# EAGLE design PCB-REMCON (EAGLE 6.4)
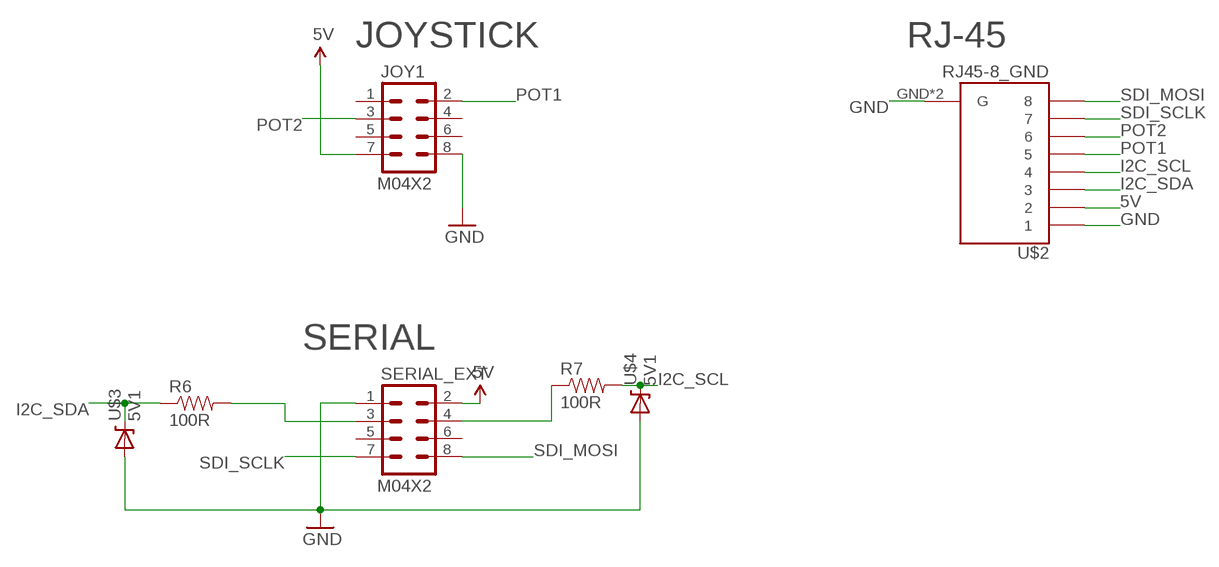
[diagram p0: schematic, sheet 1]

## Parts
JOY1  M04X2  [2X4]
R6  100R  RESISTOR0603-RES  [0603-RES]
R7  100R  RESISTOR0603-RES  [0603-RES]
SERIAL_EXT  M04X2  [2X4]
U$2  RJ45-8_GND  [RJ45-8_GND]
U$3  5V1  DIODE-ZENERPTH  [DIODE-ZENER]
U$4  5V1  DIODE-ZENERPTH  [DIODE-ZENER]

## Nets
5V [Power]: JOY1.7 SERIAL_EXT.2 U$2.2
GND [Power]: JOY1.8 SERIAL_EXT.1 U$2.1 U$2.GND1(G) U$2.GND(G) U$3.P$2(A) U$4.P$2(A)
I2C_SCL: R7.2 U$2.4 U$4.P$1(C)
I2C_SDA: R6.1 U$2.3 U$3.P$1(C)
N$1: R6.2 SERIAL_EXT.3
N$14: R7.1 SERIAL_EXT.4
POT1: JOY1.2 U$2.5
POT2: JOY1.3 U$2.6
SDI_MOSI: SERIAL_EXT.8 U$2.8
SDI_SCLK: SERIAL_EXT.7 U$2.7
Unconnected: JOY1.1 JOY1.4 JOY1.5 JOY1.6 SERIAL_EXT.5 SERIAL_EXT.6

## Notes on the sheet
- JOYSTICK | RJ-45
- SERIAL

## Library data of the parts
JOY1 SERIAL_EXT = SparkFun:M04X2
R6 R7 = SparkFun:RESISTOR: Resistor Basic schematic elements and footprints for 0603, 1206, and PTH resistors.
U$2 = SKAARHOJ:RJ45-8_GND
U$3 U$4 = SparkFun:DIODE-ZENER: Zener Diode Production Part - 8199 3.4V Zener Voltage

## Net classes
0 default: width 0.203 mm, drill 0.406 mm, clearance 0.203 mm
1 Power: width 0.406 mm, drill 0.61 mm, clearance 0.203 mm

## Board
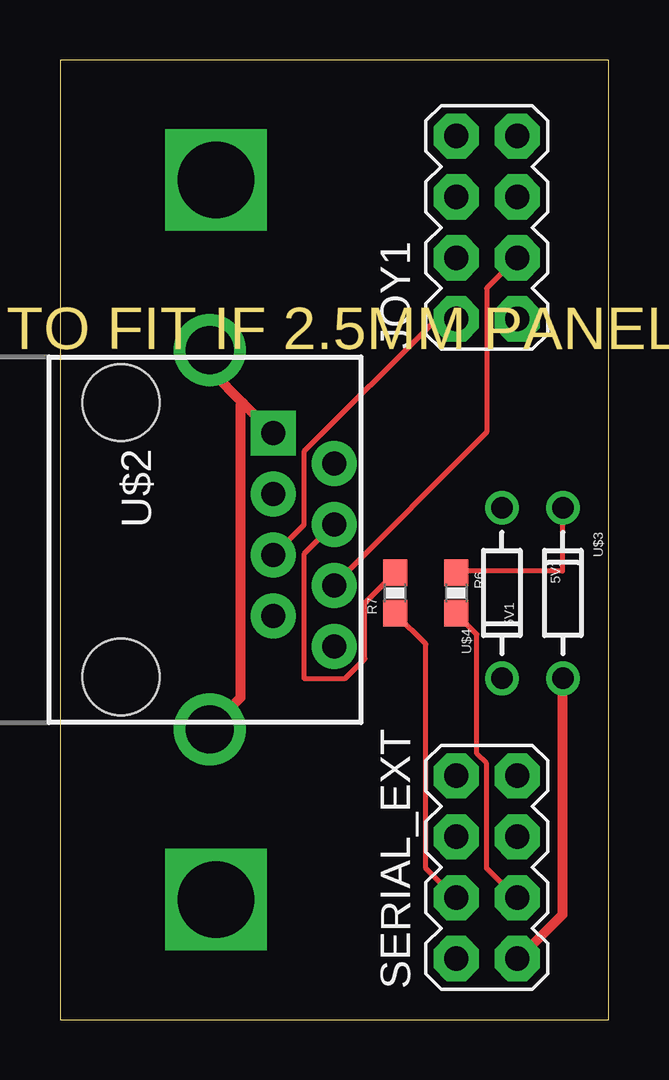
[diagram p1: board, top side]
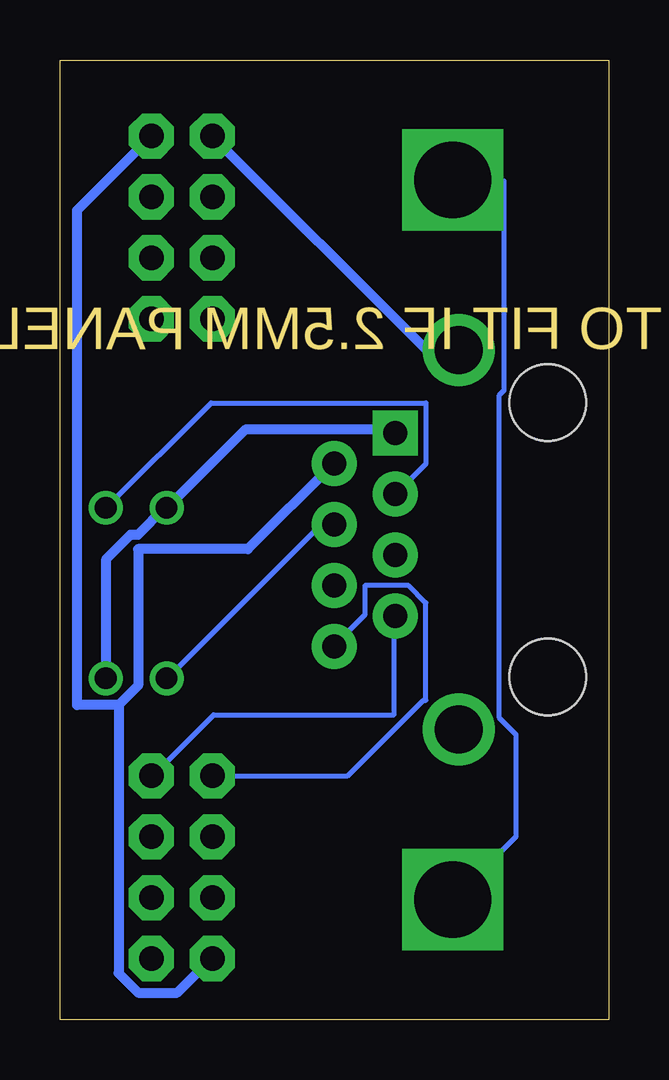
[diagram p2: board, bottom side, seen from below]

Size 22.86 x 40 mm. Coordinates in mm from the lower left corner, seen from the top.
Outline: 0,0 22.86,0 22.86,40 0,40 0,0
Copper layers (1*16): Top 0.035mm / dielectric 1.5mm / Bottom 0.035mm
Design rules "Fusion_eagle_rule_v1.1": minimum track width 6mil, minimum drill 12mil, track to track 6mil, track to pad 6mil, pad to pad 6mil, via to via 6mil, smd to smd 0mil, copper to edge 10mil, drill to drill 10mil, minimum pad ring 10mil, minimum via ring 6mil, stop-mask expansion 2mil, vias tented up to drill 100mil, thermal gap 10mil
tRestrict: area 0,0 to 10.2,10.2; area 0,30.5 to 10.2,40.6

### Footprints (pad centres in the part's own frame; a part is rotated, then mirrored left to right if it is on the bottom)
2X4 = drill 1.016 pad 1.88 octagon: 1 -3.81,-1.27; 2 -3.81,1.27; 3 -1.27,-1.27; 4 -1.27,1.27; 5 1.27,-1.27; 6 1.27,1.27; 7 3.81,-1.27; 8 3.81,1.27
0603-RES = smd 1.1 x 1: 1 -0.85,0; 2 0.85,0
RJ45-8_GND = drill 1 pad 1.88 square: 1 -4.445,6.35 | drill 1 pad 1.88: 2 -3.175,8.89; 3 -1.905,6.35; 4 -0.635,8.89; 5 0.635,6.35; 6 1.905,8.89; 7 3.175,6.35; 8 4.445,8.89 | drill 2: GND -7.9,3.7; GND1 7.9,3.7 | hole 3.2: -5.715,0; 5.715,0
DIODE-ZENER = drill 0.9: P$1 -3.556,0; P$2 3.556,0

### Placement (x,y rotation side)
JOY1  17.78,33.02 90 top
R6  16.51,17.78 270 top
R7  13.97,17.78 90 top
SERIAL_EXT  17.78,6.35 90 top
U$2  2.54,20 270 top
U$3  20.95,17.78 270 top
U$4  18.41,17.78 90 top

### Tracks (layer width: path | path; a pad name or v marks a point on that pad's centre or on a via)
5V
  Bottom 0.406: 20.42,13.11 20.42,1.93 19.61,1.12 17.98,1.12 16.56,2.54 SERIAL_EXT.2 | 20.42,13.11 19.61,13.92 19.61,19.61 15.04,19.61 11.48,23.16 U$2.2 | JOY1.7 22.15,33.73 22.15,13.11 20.42,13.11
GND
  Top 0.406: SERIAL_EXT.1 19.1,2.54 20.93,4.37 20.93,14.22 U$3.P$2 | 7.62,25.7 6.3,27.03 6.3,27.84 U$2.GND | 7.62,25.7 8.84,24.49 U$2.1 | U$2.GND1 6.3,12.19 7.52,13.41 7.52,25.6 7.62,25.7
  Bottom 0.406: U$3.P$2 20.93,14.22 20.93,19.2 19.91,20.22 19.61,20.22 18.49,21.34 U$4.P$2 18.29,21.44 15.14,24.59 9.04,24.59 8.94,24.49 U$2.1 | JOY1.8 7.62,27.94 6.3,27.94 U$2.GND
I2C_SCL
  Top 0.203: R7.2 13.92,18.59 12.7,17.37 12.7,15.04 11.89,14.22 10.16,14.22 10.16,19.41 11.38,20.62 U$2.4
  Bottom 0.203: U$4.P$1 18.39,14.22 11.99,20.62 11.48,20.62 U$2.4
I2C_SDA
  Top 0.203: R6.1 16.56,18.69 20.93,18.69 20.93,21.34 U$3.P$1
  Bottom 0.203: U$2.3 8.84,21.95 7.62,23.16 7.62,25.7 16.56,25.7 20.93,21.34 U$3.P$1
N$1
  Top 0.203: R6.2 16.56,16.87 17.37,16.05 17.37,11.07 17.78,10.67 17.78,6.3 19,5.08 SERIAL_EXT.3
N$2  (via drill 3.2)
  Bottom 0.203: v6.5,5 6.4,5.08 3.86,7.62 3.86,11.89 4.57,12.6 4.57,26.01 4.37,26.21 4.37,34.95 6.4,34.95 v6.5,35
N$14
  Top 0.203: R7.1 14.02,16.87 15.24,15.65 15.24,6.3 16.46,5.08 SERIAL_EXT.4
POT1
  Top 0.203: U$2.5 8.94,19.41 10.16,20.62 10.16,23.67 15.65,29.16 16.46,29.16 JOY1.2
POT2
  Top 0.203: JOY1.3 17.78,30.48 17.78,24.49 11.48,18.19 U$2.6
SDI_MOSI
  Bottom 0.203: SERIAL_EXT.8 10.87,10.16 7.72,13.31 7.62,13.31 7.62,17.37 8.33,18.09 10.16,18.09 10.16,16.87 11.38,15.65 U$2.8
SDI_SCLK
  Bottom 0.203: U$2.7 8.94,16.76 8.94,12.7 16.46,12.7 19,10.16 SERIAL_EXT.7

### Text on the board
Dimension: MOVE PLUG TO FIT IF 2.5MM PANEL NEEDS BLOCKING!